# Altium schematic sheet Synchronizer.SchDoc
size 420 x 297 mm; SheetNumber: 1; SheetTotal: 1
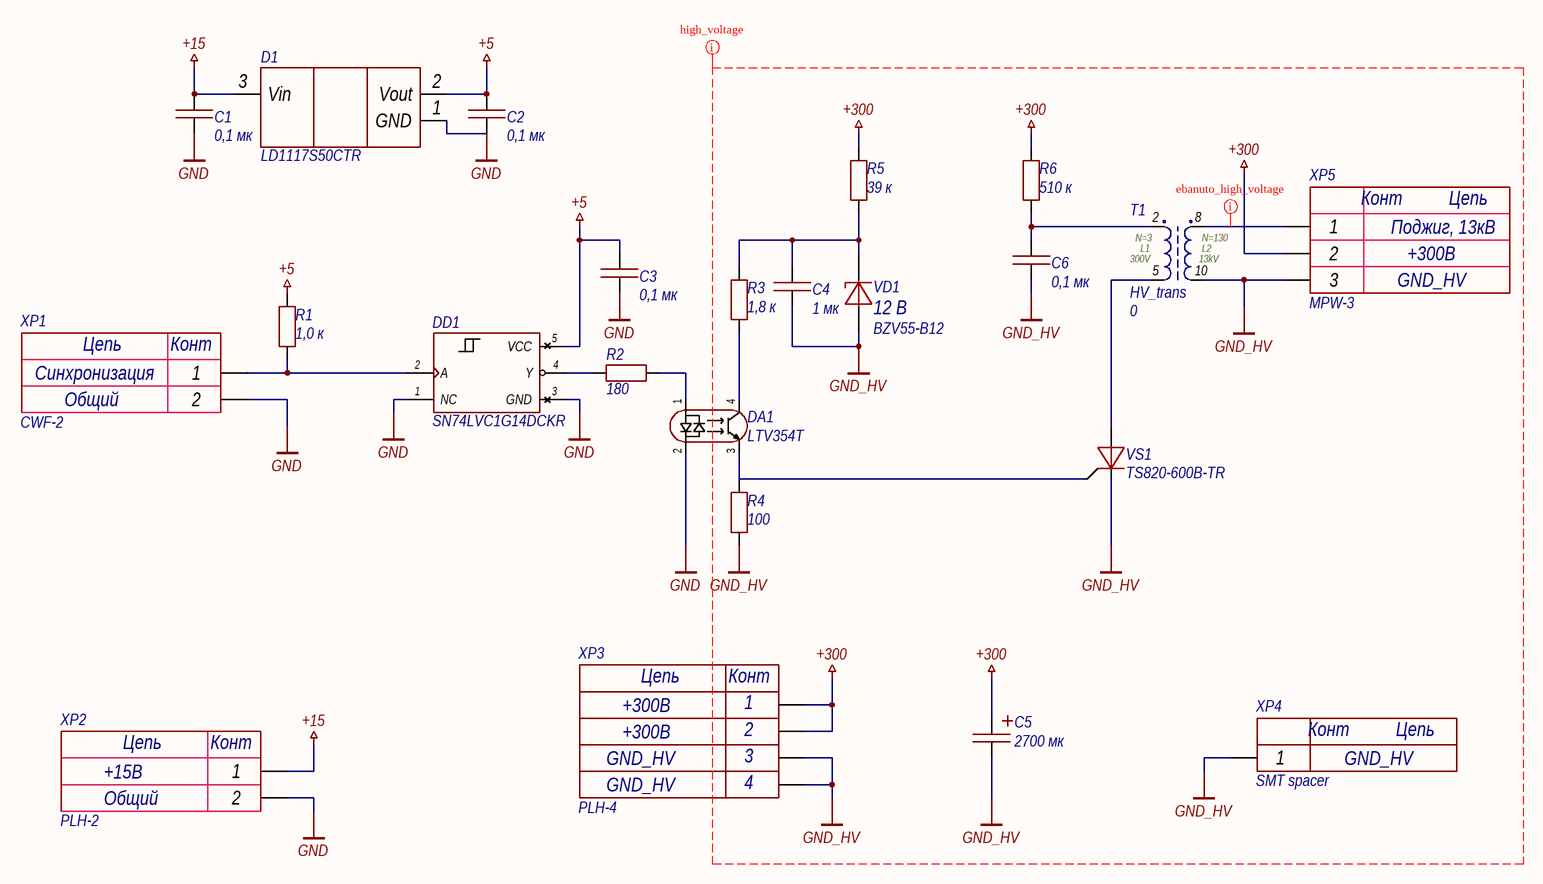
[diagram p0: Synchronizer.SchDoc]

## Parts
C1  value 0,1 мк  [0603C]  (hidden comment: Capacitor)
C2  value 0,1 мк  [0603C]  (hidden comment: Capacitor)
C3  value 0,1 мк  [0603C]  (hidden comment: Capacitor)
C4  value 1 мк  [0603C]  (hidden comment: Capacitor)
C5  value 2700 мк  [42x103_radial]  (hidden comment: Capacitor_polar)
C6  value 0,1 мк  [1812C]  (hidden comment: Capacitor)
D1  LD1117S50CTR  [SOT223]
DA1  LTV354T  [SOP4-2_54]
DD1  SN74LVC1G14DCKR  [SC-70-5]
R1  value 1,0 к  [0603R]  (hidden comment: Resistor)
R2  value 180  [0603R]  (hidden comment: Resistor)
R3  value 1,8 к  [0603R]  (hidden comment: Resistor)
R4  value 100  [0603R]  (hidden comment: Resistor)
R5  value 39 к  [0603R]  (hidden comment: Resistor)
R6  value 510 к  [0603R]  (hidden comment: Resistor)
T1  HV_trans  value 0  [EE16_transformer]
VD1  BZV55-B12  value 12 В  [mini_MELF_3.5mm]
VS1  TS820-600B-TR  [DPAK]
XP1  CWF-2  Value2: Общий  Value1: Синхронизация  [CWF-2]
XP2  PLH-2  Value2: Общий  Value1: +15В  [PLH2_type18]
XP3  PLH-4  Value3: GND_HV  Value2: +300В  [PLH4_type18]
XP4  SMT spacer  Value1: GND_HV  [9774030151]
XP5  MPW-3  Value3: GND_HV  Value2: +300В  Value1: Поджиг, 13кВ  [MPW-3]

## Nets
+5: C2.2 C3.2 D1.2(Vout) DD1.5(VCC) R1.2
+15: C1.2 D1.3(Vin) XP2.1
+300: C5.1 R5.2 R6.2 XP3.1 XP3.2 XP5.2
GND: C1.1 C2.1 C3.1 D1.1(GND) DA1.2(C) DD1.1(NC) DD1.3(GND) XP1.2 XP2.2
GND_HV: C4.1 C5.2 C6.1 R4.1 T1.10 VD1.1 VS1.1 XP3.3 XP3.4 XP4.1 XP5.3
NetC4_2: C4.2 R3.2 R5.1 VD1.2
NetC6_2: C6.2 R6.1 T1.2
NetDA1_1: DA1.1(A) R2.2
NetDA1_3: DA1.3(ET) R4.2 VS1.3
NetDA1_4: DA1.4(CT) R3.1
NetDD1_2: DD1.2(A) R1.1 XP1.1
NetDD1_4: DD1.4(Y) R2.1
NetT1_5: T1.5 VS1.2
NetT1_8: T1.8 XP5.1

## Layout directives
net class high_voltage: +300, GND_HV
net class ebanuto_high_voltage: NetT1_8

## Notes on the sheet
- Перв. примен.
- Справ. №
- Подп. и дата
- Инв. № дубл.
- Взам. инв. №
- Разраб.
- Изм.
- Лист
- № докум.
- Подп.
- Дата
- Лит.
- Масса
- Масштаб
- Пров.
- Т.контр.
- Схема электрическая принципиальная
- Листов
- Инв. № подл.
- Утв.
- Н.контр.
- Копировал
- Формат А3
- (in symbol CWF-2) Цепь; Конт
- (in symbol HV_trans) N=3; N=130; L1; L2; 300V; 13kV
- (in symbol MPW-3) Конт; Цепь
- (in symbol PLH-2) Цепь; Конт
- (in symbol PLH-4) Цепь; Конт
- (in symbol SMT_spacer_nut) Конт; Цепь

## Library data of the parts
C1-C3 = Capacitor_0,1u_10_50V_X7R_0603C: Конденсатор; Library Path2: Schematic\Capacitor.SchLib; Tolerance: 0,1; Voltage (V): 50; Dielectric: X7R; Capacity (nF): 100; Part Number: Capacitor_0,1u_10_50V_X7R_0603C
C4 = Capacitor_1u_10_50V_X7R_0603C: Конденсатор; Library Path2: Schematic\Capacitor.SchLib; Tolerance: 0,1; Voltage (V): 50; Dielectric: X7R; Capacity (nF): 1000; Part Number: Capacitor_1u_10_50V_X7R_0603C
C5 = JCCON 2700uF 400V: Конденсатор алюминиевый электролитический 2700мкФ 400В 20%; Tolerance: 20; Voltage (V): 400; Type: Aluminum; Capacity (uF): 2700; Part Number: JCCON 2700uF 400V
C6 = Capacitor_0,1u_10_1000V_X7R_1812C: Конденсатор; Library Path2: Schematic\Capacitor.SchLib; Tolerance: 0,1; Voltage (V): 1000; Dielectric: X7R; Capacity (nF): 100; Part Number: Capacitor_0,1u_10_1000V_X7R_1812C
D1 = LD1117S50CTR: Линейный стабилизатор напряжения; Part Number: LD1117S50CTR
DA1 = LTV354T: Оптопара с транзисторным выходом, UMW; SnapEDA_Link: https://www.snapeda.com/parts/LTV816/Lite-On/view-part/?ref=snap; Check_prices: https://www.snapeda.com/parts/LTV816/Lite-On/view-part/?ref=eda; Value: *; Part Number: LTV354T
DD1 = SN74LVC1G14DCKR: Одноканальный инвертор с триггером Шмитта; Part Number: SN74LVC1G14DCKR
R1 = Resistor_1.0k_1_0603: Резистор номиналом 1,0 кОм и точностью 1%; Power: *; Part Number: Resistor_1.0k_1_0603; Tolerance: 1%
R2 = Resistor_180_1_0603: Резистор номиналом 180 Ом и точностью 1%; Power: *; Part Number: Resistor_180_1_0603; Tolerance: 1%
R3 = Resistor_1.8k_1_0603: Резистор номиналом 1,8 кОм и точностью 1%; Power: *; Part Number: Resistor_1.8k_1_0603; Tolerance: 1%
R4 = Resistor_100_1_0603: Резистор номиналом 100 Ом и точностью 1%; Power: *; Part Number: Resistor_100_1_0603; Tolerance: 1%
R5 = Resistor_39k_1_0603: Резистор номиналом 39 кОм и точностью 1%; Power: *; Part Number: Resistor_39k_1_0603; Tolerance: 1%
R6 = Resistor_510k_1_0603: Резистор номиналом 510 кОм и точностью 1%; Power: *; Part Number: Resistor_510k_1_0603; Tolerance: 1%
T1 = HV_trans: Импульсный трансформатор для поджига вспышки; Current (A): 10000; Part Number: HV_trans
VD1 = BZV55-B12: Стабилитрон 12В, 5%, 0.5Вт; Voltage nominal (V): 12; Current nominal (mA): 5; Power (W): 0.5; Accuracy: 0,02; Part Number: BZV55-B12
VS1 = TS820-600B-TR: Тиристор 600В 8А; Part Number: TS820-600B-TR; Напряжение: 600 В; Ток макс#: 8 А
XP1 = CWF-2: 2-пиновый разъем с ключом; System: Connector; Part Number: CWF-2; Datasheet: https://static.chipdip.ru/lib/413/DOC001413777.pdf
XP2 = PLH-2: Гребенка высокая 2 пина типоразмер 18 (промежуток 10.4мм) Connfly; System: Connector; Part Number: PLH-2; Datasheet: https://static.chipdip.ru/lib/530/DOC059530234.pdf
XP3 = PLH-4: Гребенка высокая 4 пина типоразмер 18 (промежуток 10.4мм) Connfly; System: Connector; Value4: GND_HV; Value1: +300В; Part Number: PLH-4; Datasheet: https://static.chipdip.ru/lib/530/DOC059530234.pdf
XP4 = SMT_spacer_nut: Стойка под пайку, М2.5, высота 3мм, SMT spacer nut - ключевые слова, Hangzhou WildChip Tech Co., Ltd. Store магазин на алике; Part Number: SMT_spacer_nut; Datasheet: https://aliexpress.ru/item/1005005620368789.html?sku_id=12000033777723210&srcSns=sns_More&businessType=ProductDetail&spreadType=socialShare&tt=MG&utm_medium=sharing
XP5 = MPW-3: MPW-3 , Вилка на плату 5.08мм прямая 3pin; System: Connector; Part Number: MPW-3